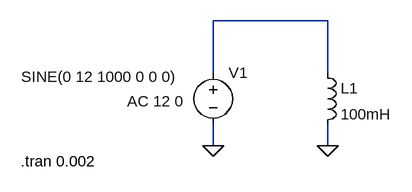
[diagram p0: schematic VoltSecondSim1.asc]
VoltSecondSim1.asc, the LTspice schematic file:
Version 4
SHEET 1 880 680
WIRE 64 48 -112 48
WIRE -112 128 -112 48
WIRE 64 128 64 48
WIRE -112 240 -112 208
WIRE 64 240 64 208
FLAG -112 240 0
FLAG 64 240 0
SYMBOL ind 48 112 R0
SYMATTR InstName L1
SYMATTR Value 100mH
SYMBOL voltage -112 112 R0
WINDOW 3 -295 22 Left 2
WINDOW 123 -132 60 Left 2
WINDOW 39 0 0 Left 0
SYMATTR InstName V1
SYMATTR Value SINE(0 12 1000 0 0 0)
SYMATTR Value2 AC 12 0
TEXT -408 264 Left 2 !.tran 0.002

The netlist it stands for:
* VoltSecondSim1.asc
L1 N001 0 100mH
V1 N001 0 SINE(0 12 1000 0 0 0) AC 12 0
.tran 0.002
.backanno
.end